# EAGLE design carm2 (EAGLE 6.4)
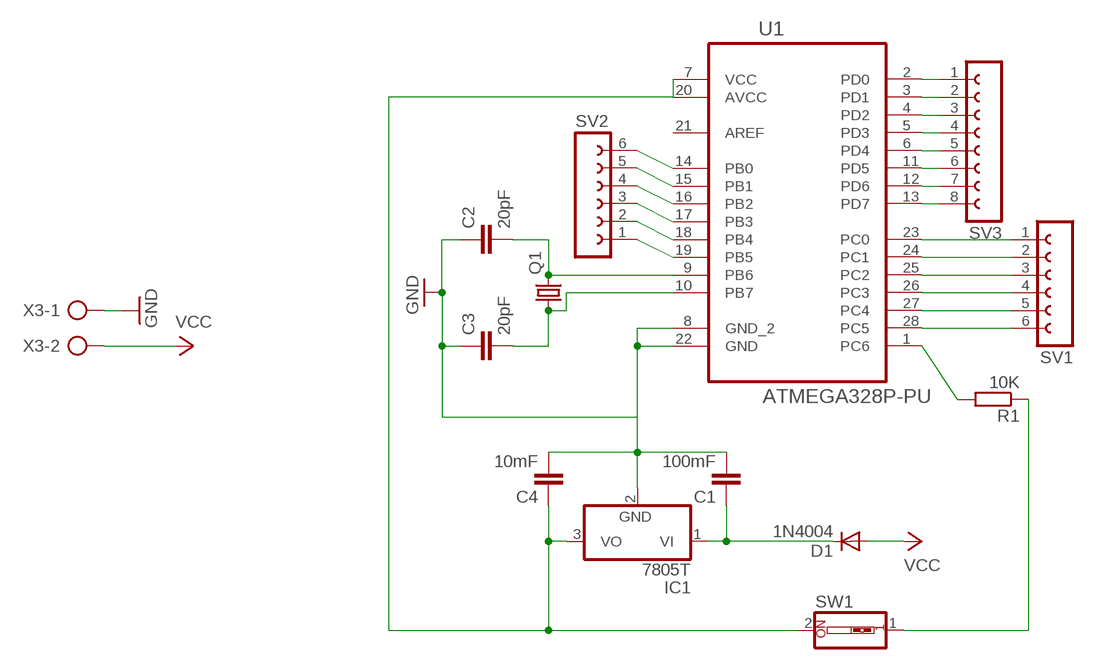
[diagram p0: schematic, sheet 1]

## Parts
C1  100mF  C10/4  [C10B4]
C2  20pF  C10/4  [C10B4]
C3  20pF  C10/4  [C10B4]
C4  10mF  C10/4  [C10B4]
D1  1N4004  [DO41-10]
IC1  7805T  [TO220H]
Q1  CRYSTALHC49S  [HC49/S]
R1  10K  R-EU_0207/10  [0207/10]
SV1  FE06-1  [FE06]
SV2  FE06-1  [FE06]
SV3  FE08-1  [FE08]
SW1  SW_DIP-1  [EDG-01]
U1  ATMEGA328P-PU  [DIP254P762X457-28]
X3  AK300/2  [AK300/2]

## Nets
GND: C1.2 C2.1 C3.1 C4.2 IC1.2(GND) U1.8(GND_2) U1.22(GND) X3.1
N$1: R1.2 U1.1(PC6)
N$2: R1.1 SW1.1
N$6: SV3.1 U1.2(PD0)
N$7: SV3.2 U1.3(PD1)
N$8: SV3.3 U1.4(PD2)
N$9: SV3.4 U1.5(PD3)
N$10: SV3.5 U1.6(PD4)
N$11: SV3.6 U1.11(PD5)
N$12: SV3.7 U1.12(PD6)
N$13: SV3.8 U1.13(PD7)
N$14: SV1.1 U1.23(PC0)
N$15: SV1.2 U1.24(PC1)
N$16: SV1.3 U1.25(PC2)
N$17: SV1.4 U1.26(PC3)
N$18: SV1.5 U1.27(PC4)
N$19: SV1.6 U1.28(PC5)
N$20: SV2.6 U1.14(PB0)
N$21: SV2.5 U1.15(PB1)
N$22: SV2.4 U1.16(PB2)
N$23: SV2.3 U1.17(PB3)
N$24: SV2.2 U1.18(PB4)
N$25: SV2.1 U1.19(PB5)
N$28: C2.2 Q1.2 U1.9(PB6)
N$30: C1.1 D1.C IC1.1(VI)
N$31: C3.2 Q1.1 U1.10(PB7)
VCC: D1.A X3.2
VCC5: C4.1 IC1.3(VO) SW1.2 U1.7(VCC) U1.20(AVCC)
Unconnected: U1.21(AREF)

## Library data of the parts
C1-C4 = capacitor-wima:C: CAPACITOR naming: grid - package width
D1 = diode:1N4004: DIODE general purpose rectifier, 1 A
IC1 = linear:78*: Positive VOLTAGE REGULATOR Source: http://cache.national.com/ds/LM/LM78L05.pdf http://www.fairchildsemi.com/ds/LM/LM7805.pdf
Q1 = crystal:CRYSTAL: CRYSTAL; OC_FARNELL: 1667008; OC_NEWARK: unknown
R1 = resistor:R-EU_: RESISTOR, European symbol
SV1 SV2 = con-lsta:FE06-1: FEMALE HEADER; OC_FARNELL: unknown; OC_NEWARK: unknown
SV3 = con-lsta:FE08-1: FEMALE HEADER; OC_FARNELL: unknown; OC_NEWARK: unknown
SW1 = special:SW_DIP-1: DIP SWITCH
U1 = ATMEGA328P-PU:ATMEGA328P-PU: 8-bit Microcontroller with In-System Programmable Flash; MPN: ATMEGA328P-PU; OC_FARNELL: 1715487; OC_NEWARK: 15R0268; PACKAGE: PDIP-28; SUPPLIER: Atmel
X3 = con-ptr500:AK300/2: CONNECTOR; OC_FARNELL: unknown; OC_NEWARK: unknown

## Net classes
0 default: clearance 0.355 mm

## Board
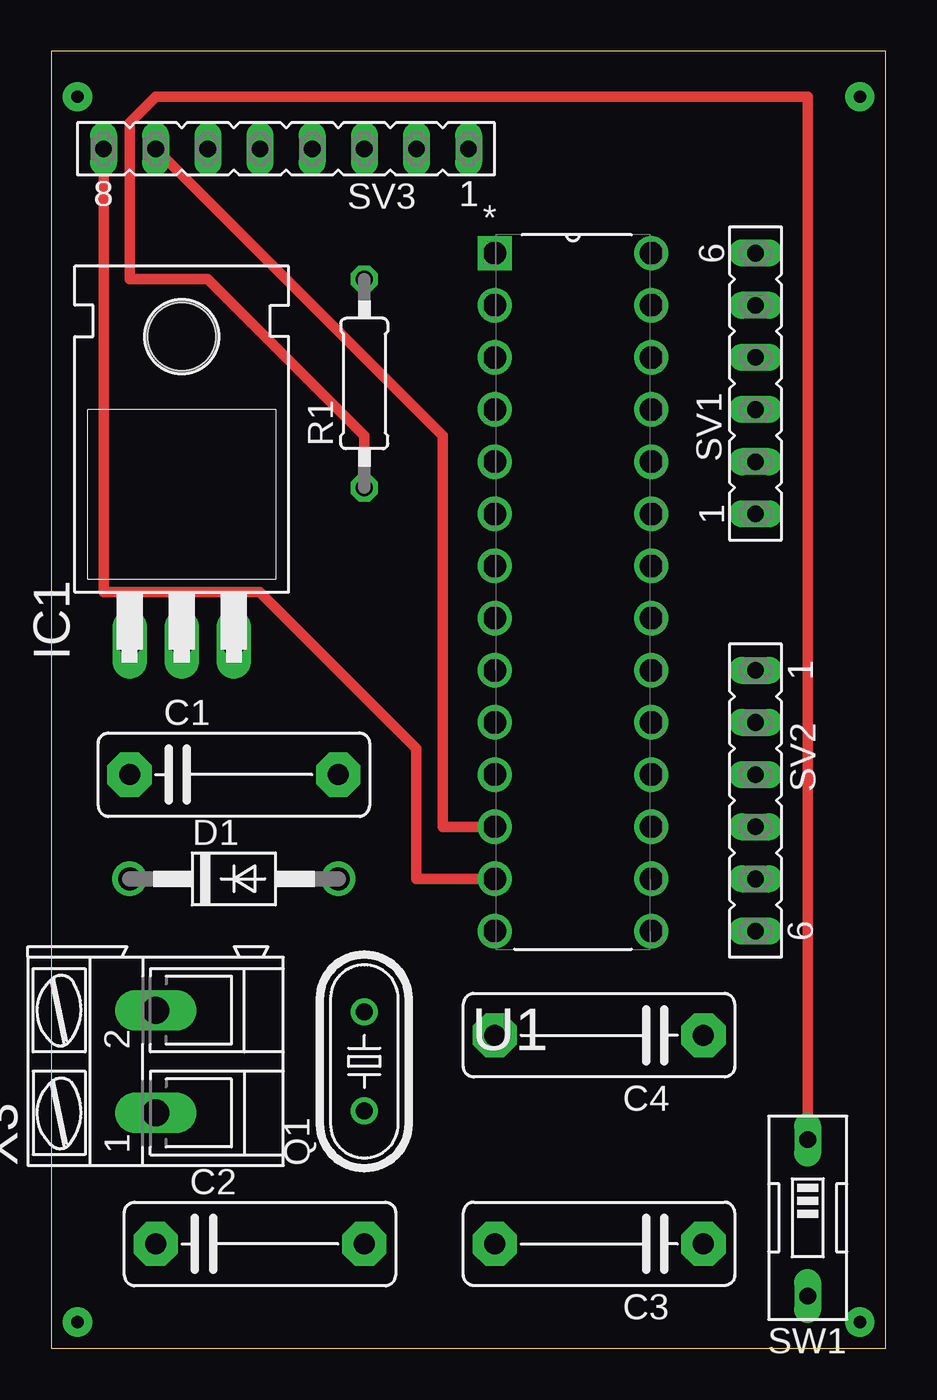
[diagram p1: board, top side]
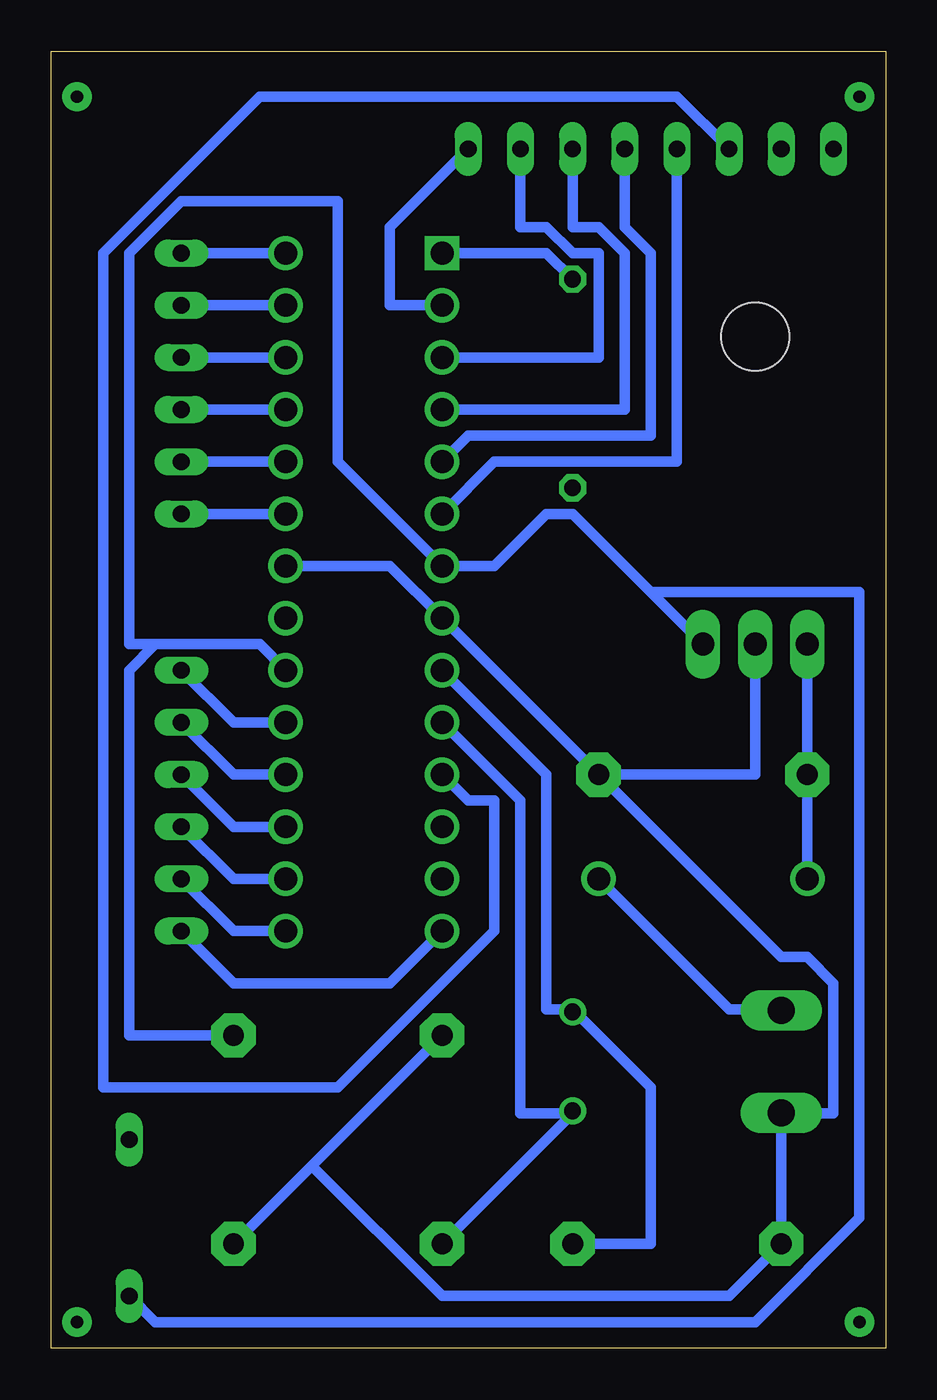
[diagram p2: board, bottom side, seen from below]

Size 40.62 x 63.17 mm. Coordinates in mm from the lower left corner, seen from the top.
Outline: 0,0 40.62,0 40.62,63.17 0,63.17 0,0
Copper layers (1*16): Top 0.035mm / dielectric 1.5mm / Bottom 0.035mm
Design rules "default": minimum track width 10mil, minimum drill 24mil, track to track 8mil, track to pad 8mil, pad to pad 8mil, via to via 8mil, smd to smd 8mil, copper to edge 40mil, drill to drill 8mil, minimum pad ring 10mil, minimum via ring 8mil, stop-mask expansion 4mil, vias tented up to drill 0mil, thermal gap 10mil

### Footprints (pad centres in the part's own frame; a part is rotated, then mirrored left to right if it is on the bottom)
C10B4 = drill 1.016 pad 2.159 octagon: 1 -5.08,0; 2 5.08,0
DO41-10 = drill 1.118: A 5.08,0; C -5.08,0
TO220H = drill 1.118 long: 1 -2.54,-10.16; 2 0,-10.16; 3 2.54,-10.16 | hole 3.302: 0,4.826
HC49/S = drill 0.813: 1 -2.413,0; 2 2.413,0
0207/10 = drill 0.813 octagon: 1 -5.08,0; 2 5.08,0
FE06 = drill 0.813 long: 1 -6.35,0; 2 -3.81,0; 3 -1.27,0; 4 1.27,0; 5 3.81,0; 6 6.35,0
FE08 = drill 0.813 long: 1 -8.89,0; 2 -6.35,0; 3 -3.81,0; 4 -1.27,0; 5 1.27,0; 6 3.81,0; 7 6.35,0; 8 8.89,0
EDG-01 = drill 0.813 long: 1 0,-3.81; 2 0,3.81
DIP254P762X457-28 = drill 1.118 square: 1 -7.62,33.02 | drill 1.118: 2 -7.62,30.48; 3 -7.62,27.94; 4 -7.62,25.4; 5 -7.62,22.86; 6 -7.62,20.32; 7 -7.62,17.78; 8 -7.62,15.24; 9 -7.62,12.7; 10 -7.62,10.16; 11 -7.62,7.62; 12 -7.62,5.08; 13 -7.62,2.54; 14 -7.62,0; 15 0,0; 16 0,2.54; 17 0,5.08; 18 0,7.62; 19 0,10.16; 20 0,12.7; 21 0,15.24; 22 0,17.78; 23 0,20.32; 24 0,22.86; 25 0,25.4; 26 0,27.94; 27 0,30.48; 28 0,33.02
AK300/2 = drill 1.321 long: 1 -2.515,0; 2 2.489,0

### Placement (x,y rotation side)
C1  8.89,27.94 0 top
C2  10.16,5.08 0 top
C3  26.67,5.08 180 top
C4  26.67,15.24 180 top
D1  8.89,22.86 0 top
IC1  6.35,44.45 0 top
Q1  15.24,13.97 90 top
R1  15.24,46.99 90 top
SV1  34.29,46.99 90 top
SV2  34.29,26.67 270 top
SV3  11.43,58.42 180 top
SW1  36.83,6.35 180 top
U1  29.21,20.32 0 top
X3  5.08,13.97 90 top

### Tracks (layer width: path | path; a pad name or v marks a point on that pad's centre or on a via)
GND
  Bottom 0.5: U1.22 24.13,38.1 U1.8 C1.2 | IC1.2 6.35,27.94 C1.2 | 5.08,11.43 C2.1 7.62,2.54 21.59,2.54 27.94,8.89 | C3.1 27.94,8.89 | 27.94,8.89 C4.2 | C1.2 5.08,19.05 3.81,19.05 2.54,17.78 2.54,11.43 5.08,11.43 | 5.08,11.43 X3.1
N$1
  Bottom 0.5: R1.2 16.51,53.34 U1.1
N$2
  Top 0.5: SW1.1 36.83,60.96 5.08,60.96 3.81,59.69 3.81,52.07 7.62,52.07 15.24,44.45 R1.1
N$3  (via drill 0.6 pad 1.42)
  other vias: 1.27,60.96
N$4  (via drill 0.6 pad 1.42)
  other vias: 39.37,60.96
N$5  (via drill 0.6 pad 1.42)
  other vias: 39.37,1.27
N$6
  Bottom 0.5: SV3.1 24.13,54.61 24.13,50.8 U1.2
N$7
  Bottom 0.5: SV3.2 17.78,54.61 16.51,54.61 15.24,53.34 13.97,53.34 13.97,48.26 U1.3
N$8
  Bottom 0.5: SV3.3 15.24,54.61 13.97,54.61 12.7,53.34 12.7,45.72 U1.4
N$9
  Bottom 0.5: SV3.4 12.7,54.61 11.43,53.34 11.43,44.45 20.32,44.45 U1.5
N$10
  Bottom 0.5: SV3.5 10.16,43.18 19.05,43.18 U1.6
N$11
  Bottom 0.5: SV3.6 10.16,60.96 30.48,60.96 38.1,53.34 38.1,12.7 26.67,12.7 19.05,20.32 19.05,26.67 20.32,26.67 U1.11
N$12
  Top 0.5: SV3.7 19.05,44.45 19.05,25.4 U1.12
N$13
  Top 0.5: SV3.8 2.54,36.83 10.16,36.83 17.78,29.21 17.78,22.86 U1.13
N$14
  Bottom 0.5: U1.23 SV1.1
N$15
  Bottom 0.5: U1.24 SV1.2
N$16
  Bottom 0.5: U1.25 SV1.3
N$17
  Bottom 0.5: U1.26 SV1.4
N$18
  Bottom 0.5: U1.27 SV1.5
N$19
  Bottom 0.5: U1.28 SV1.6
N$20
  Bottom 0.5: SV2.6 31.75,17.78 24.13,17.78 U1.14
N$21
  Bottom 0.5: SV2.5 31.75,20.32 U1.15
N$22
  Bottom 0.5: SV2.4 31.75,22.86 U1.16
N$23
  Bottom 0.5: SV2.3 31.75,25.4 U1.17
N$24
  Bottom 0.5: SV2.2 31.75,27.94 U1.18
N$25
  Bottom 0.5: SV2.1 31.75,30.48 U1.19
N$26  (via drill 0.6 pad 1.42)
  other vias: 1.27,1.27
N$28
  Bottom 0.5: 15.24,16.51 11.43,12.7 11.43,5.08 C2.2 | U1.9 16.51,27.94 16.51,16.51 15.24,16.51 | 15.24,16.51 Q1.2
N$30
  Bottom 0.5: D1.C C1.1 IC1.1
N$31
  Bottom 0.5: C3.2 15.24,11.43 | U1.10 17.78,26.67 17.78,11.43 15.24,11.43 | 15.24,11.43 Q1.1
VCC
  Bottom 0.5: D1.A 7.62,16.51 5.08,16.51 X3.2
VCC5
  Bottom 0.5: 11.43,36.83 15.24,40.64 16.51,40.64 19.05,38.1 U1.7 26.67,43.18 26.67,55.88 34.29,55.88 36.83,53.34 36.83,34.29 35.56,34.29 | 11.43,36.83 IC1.3 | U1.20 30.48,34.29 35.56,34.29 | 35.56,34.29 36.83,33.02 36.83,15.24 C4.1 | SW1.2 35.56,1.27 6.35,1.27 1.27,6.35 1.27,36.83 11.43,36.83